# Altium schematic sheet SENS.SchDoc
size A2; SheetNumber: 8; SheetTotal: 8
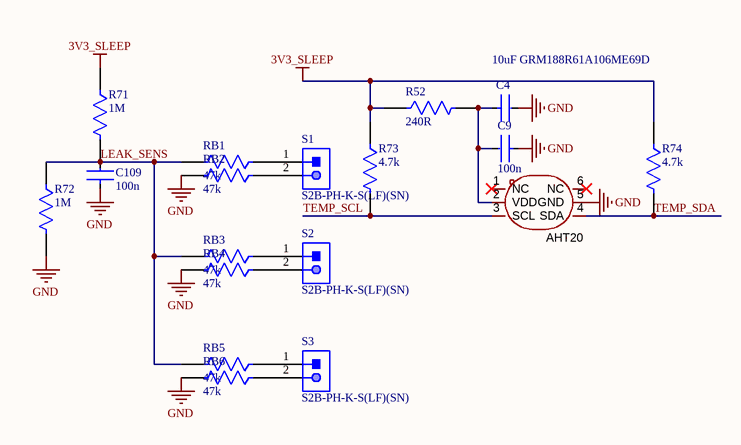
[diagram p0: SENS.SchDoc]

## Parts
C4  10uF GRM188R61A106ME69D  [FP-GRM188-0_15-MFG]
C9  100n  [CAP_0402]
C109  100n  [CAP_0402]
R52  240R  [RES_0402]
R71  1M  [RES_0402]
R72  1M  [RES_0402]
R73  4.7k  [RES_0402]
R74  4.7k  [RES_0402]
RB1  47k  [RES_0402]
RB2  47k  [RES_0402]
RB3  47k  [RES_0402]
RB4  47k  [RES_0402]
RB5  47k  [RES_0402]
RB6  47k  [RES_0402]
S1  S2B-PH-K-S(LF)(SN)  [JST-S2B-PH-K-S_V]
S2  S2B-PH-K-S(LF)(SN)  [JST-S2B-PH-K-S_V]
S3  S2B-PH-K-S(LF)(SN)  [JST-S2B-PH-K-S_V]
U17  AHT20  [AHT30]

## Nets
3V3_SLEEP: R52.1 R71.1 R73.1 R74.1
GND: C4.2 C9.1 C109.1 R72.2 RB2.2 RB4.2 RB6.2 U17.5(GND)
LEAK_SENS: C109.2 R71.2 R72.1 RB1.2 RB3.2 RB5.2
TEMP_SCL: R73.2 U17.3(SCL)
TEMP_SDA: R74.2 U17.4(SDA)
NetC4_1: C4.1 C9.2 R52.2 U17.2(VDD)
NetRB1_1: RB1.1 S1.1
NetRB2_1: RB2.1 S1.2
NetRB3_1: RB3.1 S2.1
NetRB4_1: RB4.1 S2.2
NetRB5_1: RB5.1 S3.1
NetRB6_1: RB6.1 S3.2

Not connected (* = marked no-connect by the designer): U17 1(NC)* 6(NC)*

## Library data of the parts
C4 = CMP-06035-003612-1: C19702; Tolerance: 20%; Dielectric: X5R; Voltage Rating: 10V; Material: Ceramic; Package Quantity: 4000; Width: 0.8mm; Case/Package: 0603; Thickness: 0.035inch; Capacitance: 10uF; Voltage Rating (DC): 10V; Termination: SMD/SMT; Length: 1.6mm; Lead Free: Lead Free; Mount: Surface Mount; Height: 0.8mm; Depth: 0.8mm; Packaging: Tape and Reel; Weight: 0.000222oz; Min Operating Temperature: -55°C; Case Code (Metric): 1608; Max Operating Temperature: 85°C; Case Code (Imperial): 0603; Value: 10uF
C9 C109 = CMP-03422-001116-1: C307331; Tolerance: 10%; Voltage Rating: 50V; Capacitance: 100nF; Value: 100nF; Max Operating Temperature: 125°C; Case Code (Metric): 1005; RoHS Compliant: Yes; Series: -; Case Code (Imperial): 0402; Min Operating Temperature: -55°C; Mount: Surface Mount; Case/Package: 0402; Packaging: Cut Tape
R52 = CMP-03412-016018-1: C324768; Tolerance: 1%; Temperature Coefficient: 100ppm/°C; Resistance: 240Ohm; Max Power Dissipation: 63mW; Value: 240Ohm; Ratings: AEC-Q200; Resistor Type: Thick Film; Number of Terminations: 2; RoHS Compliant: Yes; Min Operating Temperature: -55°C; Case/Package: 0402; Series: AC; Length: 0.039inch; Width: 0.02inch; Features: Moisture Resistant; Height: 0.015inch; Packaging: Tape and Reel; Max Operating Temperature: 155°C
R71 R72 = CMP-03412-016018-1: C26083; Tolerance: 1%; Temperature Coefficient: 100ppm/°C; Resistance: 1MOhm; Max Power Dissipation: 63mW; Value: 1MOhm; Ratings: AEC-Q200; Resistor Type: Thick Film; Number of Terminations: 2; RoHS Compliant: Yes; Min Operating Temperature: -55°C; Case/Package: 0402; Series: AC; Length: 0.039inch; Width: 0.02inch; Features: Moisture Resistant; Height: 0.015inch; Packaging: Tape and Reel; Max Operating Temperature: 155°C
R73 R74 = CMP-03412-016018-1: C25900; Tolerance: 1%; Temperature Coefficient: 100ppm/°C; Resistance: 4.7kOhm; Max Power Dissipation: 63mW; Value: 4.7kOhm; Ratings: AEC-Q200; Resistor Type: Thick Film; Number of Terminations: 2; RoHS Compliant: Yes; Min Operating Temperature: -55°C; Case/Package: 0402; Series: AC; Length: 0.039inch; Width: 0.02inch; Features: Moisture Resistant; Height: 0.015inch; Packaging: Tape and Reel; Max Operating Temperature: 155°C
RB1-RB6 = CMP-03412-016018-1: C25792; Tolerance: 1%; Temperature Coefficient: 100ppm/°C; Resistance: 47kOhm; Max Power Dissipation: 63mW; Value: 47kOhm; Ratings: AEC-Q200; Resistor Type: Thick Film; Number of Terminations: 2; RoHS Compliant: Yes; Min Operating Temperature: -55°C; Case/Package: 0402; Series: AC; Length: 0.039inch; Width: 0.02inch; Features: Moisture Resistant; Height: 0.015inch; Packaging: Tape and Reel; Max Operating Temperature: 155°C
S1-S3 = CMP-1755-00004-1: C157932; Case\Package: Radial; Tolerance: 20%; Capacitance: 10 uF; Voltage Rating (DC): 50 V; Packaging: Bulk; ComponentLink1URL: http://www.jst-mfg.com/product/pdf/eng/ePH.pdf; Radiation Hardening: No; Height: 11 mm; Package Quantity: 200; PackageDescription: Male Header, Pitch 2 mm, 1 x 2 Position, Height 4.8 mm, Tail Length 3.4 mm; PackageReference: S2B-PH-K-S; Diameter: 5 mm; Pins: 2; Mount: Through Hole; Max Operating Temperature: 85 degC; Min Operating Temperature: -40 degC; ComponentLink1Description: Datasheet; DatasheetVersion: Dec-12; Length: 11 mm; Lead Pitch: 2 mm; REACH SVHC: No SVHC; Voltage Rating: 50 V; RoHSCompliant: true
U17 = aht30_c45354925: C2757850; Manufacturer: 广州奥松; AddInBom: yes; ModelId: 157746d41b2d4f19849b880ea67ac3ea; ModelName: MIC-SMD_6P-L3.0-W3.0-P1.00-TL; ModelTransform: 118.11,118.11,0,0,0,0,0.006,-0.001,0; Humidity: 0%RH~100%RH; Interface: I2C; Voltage - Supply: 2.2V~5.5V; Current - Supply: 570uA; Humidity Tolerance: ±3%RH; Temperature Tolerance: ±0.5℃; Symbol: AHT30_C45354925; LCSC Part Name: 温湿度传感器; SupplierPart: C45354925; ManufacturerPart: AHT30; Supplier Footprint: SMD-6P,3x3mm; JLCPCB Part Class: Extended Part; Datasheet: https://item.szlcsc.com/datasheet/AHT30/47444209.html; Supplier: LCSC; ConvertToPcb: yes; FootprintName: MIC-SMD_6P-L3.0-W3.0-P1.00-TL; Temperature Range: -40℃~+120℃; Resolution: -; Features: Factory calibration